# EAGLE design raindrops (EAGLE 6.3)
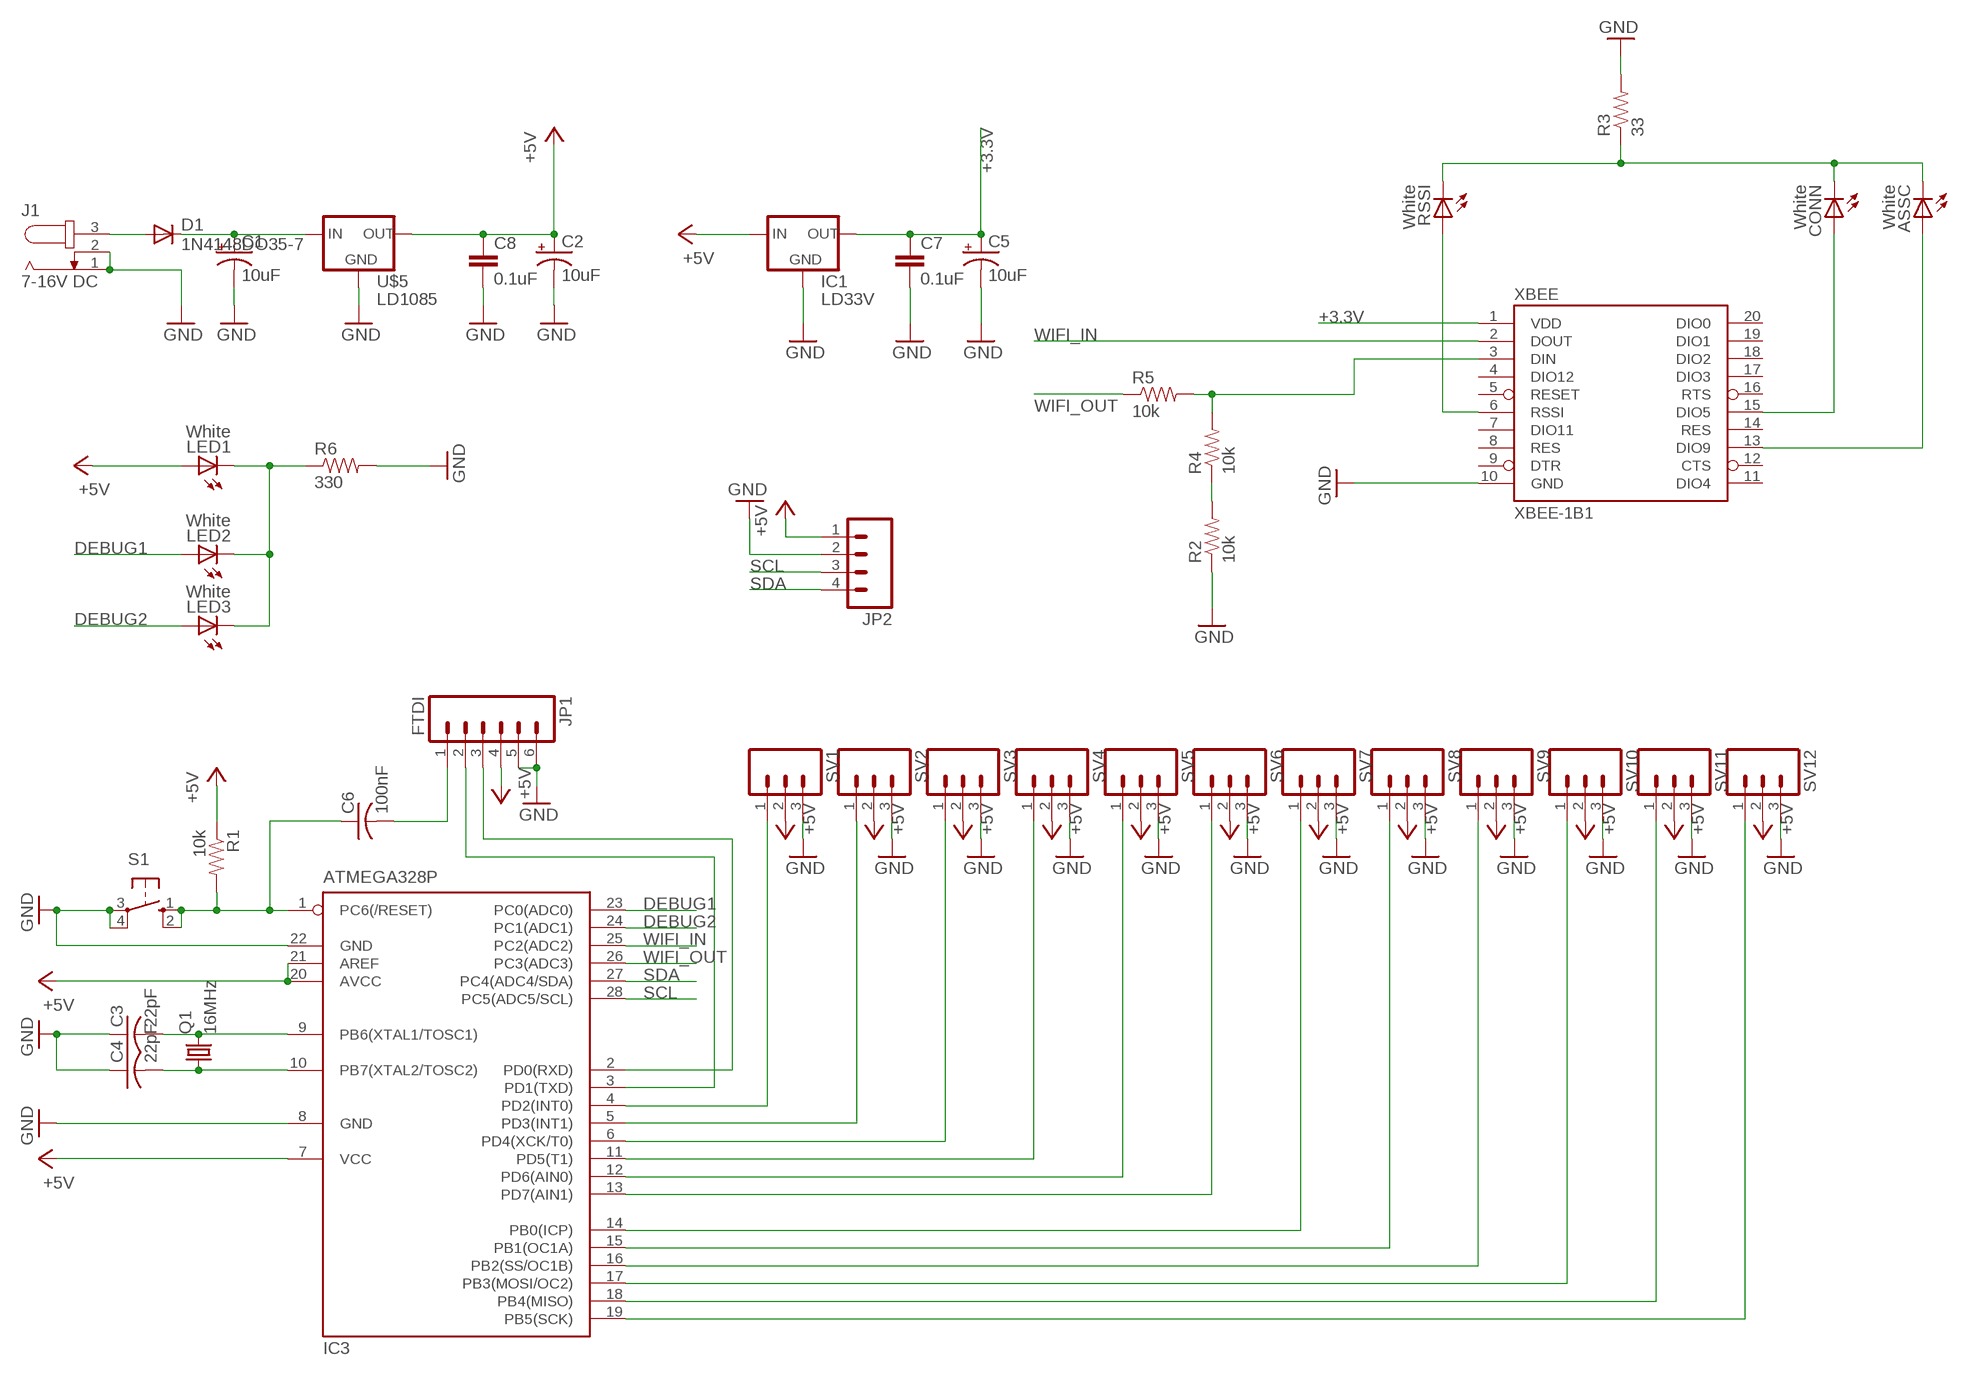
[diagram p0: schematic, sheet 1]

## Parts
ASSC  White  LEDCHIPLED_0603  [CHIPLED_0603]
C1  10uF  CAP_POLPTH2  [CPOL-RADIAL-10UF-25V]
C2  10uF  CAP_POLPTH2  [CPOL-RADIAL-10UF-25V]
C3  22pF  C-US025-025X050  [C025-025X050]
C4  22pF  C-US025-025X050  [C025-025X050]
C5  10uF  CAP_POLPTH2  [CPOL-RADIAL-10UF-25V]
C6  100nF  C-US025-025X050  [C025-025X050]
C7  0.1uF  .1UF-CER  [0402-CAP]
C8  0.1uF  .1UF-CER  [0402-CAP]
CONN  White  LEDCHIPLED_0603  [CHIPLED_0603]
D1  1N4148DO35-7  [DO35-7]
IC1  LD33V  V_REG_LD1117VXX  [78XXL]
IC3  ATMEGA328P  MEGA8-P  [DIL28-3]
J1  7-16V DC  JACK-PLUG0  [SPC4077]
JP1  FTDI  M06SIP  [1X06]
JP2  M04PTH  [1X04]
LED1  White  LEDCHIPLED_0603  [CHIPLED_0603]
LED2  White  LEDCHIPLED_0603  [CHIPLED_0603]
LED3  White  LEDCHIPLED_0603  [CHIPLED_0603]
Q1  16MHz  CRYSTALHC49S  [HC49/S]
R1  10k  RESISTOR0603-RES  [0603-RES]
R2  10k  RESISTOR0603-RES  [0603-RES]
R3  33  RESISTORAXIAL-0.3  [AXIAL-0.3]
R4  10k  RESISTOR0603-RES  [0603-RES]
R5  10k  RESISTOR0603-RES  [0603-RES]
R6  330  RESISTORAXIAL-0.3  [AXIAL-0.3]
RSSI  White  LEDCHIPLED_0603  [CHIPLED_0603]
S1  10-XX  [B3F-10XX]
SV1  M03PTH  [1X03]
SV2  M03PTH  [1X03]
SV3  M03PTH  [1X03]
SV4  M03PTH  [1X03]
SV5  M03PTH  [1X03]
SV6  M03PTH  [1X03]
SV7  M03PTH  [1X03]
SV8  M03PTH  [1X03]
SV9  M03PTH  [1X03]
SV10  M03PTH  [1X03]
SV11  M03PTH  [1X03]
SV12  M03PTH  [1X03]
U$5  LD1085  V_REG_LD1117VXX  [78XXL]
XBEE  XBEE-1B1  [XBEE-1]

## Nets
+3.3V: C5.1(+) C7.1 IC1.GND(OUT) XBEE.1(VDD)
+5V: C2.1(+) C8.1 IC1.OUT(IN) IC3.7(VCC) IC3.20(AVCC) IC3.21(AREF) JP1.4 JP2.1 LED1.A R1.1 SV1.2 SV2.2 SV3.2 SV4.2 SV5.2 SV6.2 SV7.2 SV8.2 SV9.2 SV10.2 SV11.2 SV12.2 U$5.GND(OUT)
ASSC: ASSC.A XBEE.13(DIO9)
CONN: CONN.A XBEE.15(DIO5)
CONN1: IC3.4(PD2(INT0)) SV1.1
CONN2: IC3.5(PD3(INT1)) SV2.1
CONN3: IC3.6(PD4(XCK/T0)) SV3.1
CONN4: IC3.11(PD5(T1)) SV4.1
CONN5: IC3.12(PD6(AIN0)) SV5.1
CONN6: IC3.13(PD7(AIN1)) SV6.1
CONN7: IC3.14(PB0(ICP)) SV7.1
CONN8: IC3.15(PB1(OC1A)) SV8.1
CONN9: IC3.16(PB2(SS/OC1B)) SV9.1
CONN10: IC3.17(PB3(MOSI/OC2)) SV10.1
CONN11: IC3.18(PB4(MISO)) SV11.1
CONN12: IC3.19(PB5(SCK)) SV12.1
DEBUG1: IC3.23(PC0(ADC0)) LED2.A
DEBUG2: IC3.24(PC1(ADC1)) LED3.A
GND: C1.2(-) C2.2(-) C3.1 C4.1 C5.2(-) C7.2 C8.2 IC1.IN(GND) IC3.8(GND) IC3.22(GND) J1.1 J1.2 JP1.5 JP1.6 JP2.2 R2.1 R3.P$2 R6.P$2 S1.3(P) S1.4(P1) SV1.3 SV2.3 SV3.3 SV4.3 SV5.3 SV6.3 SV7.3 SV8.3 SV9.3 SV10.3 SV11.3 SV12.3 U$5.IN(GND) XBEE.10(GND)
LED-RESISTOR: LED1.C LED2.C LED3.C R6.P$1
N$22: C6.2 JP1.1
RESET: C6.1 IC3.1(PC6(/RESET)) R1.2 S1.1(S) S1.2(S1)
RSSI: RSSI.A XBEE.6(RSSI)
RXO: IC3.2(PD0(RXD)) JP1.3
SCL: IC3.28(PC5(ADC5/SCL)) JP2.3
SDA: IC3.27(PC4(ADC4/SDA)) JP2.4
TXO: IC3.3(PD1(TXD)) JP1.2
V-DIV: R2.2 R4.1
VIN-POST-DIODE: C1.1(+) D1.C U$5.OUT(IN)
VIN-PRE-DIODE: D1.A J1.3
WIFI_IN: IC3.25(PC2(ADC2)) XBEE.2(DOUT)
WIFI_OUT: IC3.26(PC3(ADC3)) R5.1
XBEE-DIN: R4.2 R5.2 XBEE.3(DIN)
XBEE-LED-RESISTOR: ASSC.C CONN.C R3.P$1 RSSI.C
XTAL1: C3.2 IC3.9(PB6(XTAL1/TOSC1)) Q1.2
XTAL2: C4.2 IC3.10(PB7(XTAL2/TOSC2)) Q1.1
Unconnected: XBEE.4(DIO12) XBEE.5(RESET) XBEE.7(DIO11) XBEE.8(RES) XBEE.9(DTR) XBEE.11(DIO4) XBEE.12(CTS) XBEE.14(RES) XBEE.16(RTS) XBEE.17(DIO3) XBEE.18(DIO2) XBEE.19(DIO1) XBEE.20(DIO0)

## Library data of the parts
ASSC CONN LED1-LED3 RSSI = led:LED: LED OSRAM: - CHIPLED LG R971, LG N971, LY N971, LG Q971, LY Q971, LO R971, LY R971 LH N974, LH R974 LS Q976, LO Q976, LY Q976 LO Q996 - Hyper CHIPLED LW Q18S LB Q993, LB Q99A, LB R99A - SideLED LS A670, LO A670, LY A670, LG A670, LP A670 LB A673, LV A673, LT A673, LW A673 LH A674 LY A675 LS A676, LA A676, LO A676, LY A676, LW A676 LS A679, LY A679, LG A679 - Hyper Micro SIDELED® LS Y876, LA Y876, LO Y876, LY Y876 LT Y87S - SmartLED LW L88C, LW L88S LB L89C, LB L89S, LG L890 LS L89K, LO L89K, LY L89K LS L896, LA L896, LO L896, LY L896 - TOPLED LS T670, LO T670, LY T670, LG T670, LP T670 LSG T670, LSP T670, LSY T670, LOP T670, LYG T670 LG T671, LOG T671, LSG T671 LB T673, LV T673, LT T673, LW T673 LH T674 LS T676, LA T676, LO T676, LY T676, LB T676, LH T676, LSB T676, LW T676 LB T67C, LV T67C, LT T67C, LS T67K, LO T67K, LY T67K, LW E67C LS E67B, LA E67B, LO E67B, LY E67B, LB E67C, LV E67C, LT E67C LW T67C LS T679, LY T679, LG T679 LS T770, LO T770, LY T770, LG T770, LP T770 LB T773, LV T773, LT T773, LW T773 LH T774 LS E675, LA E675, LY E675, LS T675 LS T776, LA T776, LO T776, LY T776, LB T776 LHGB T686 LT T68C, LB T68C - Hyper Mini TOPLED® LB M676 - Mini TOPLED Santana® LG M470 LS M47K, LO M47K, LY M47K Source: http://www.osram.convergy.de LUXEON: - LUMILED® LXK2-PW12-R00, LXK2-PW12-S00, LXK2-PW14-U00, LXK2-PW14-V00 LXK2-PM12-R00, LXK2-PM12-S00, LXK2-PM14-U00 LXK2-PE12-Q00, LXK2-PE12-R00, LXK2-PE12-S00, LXK2-PE14-T00, LXK2-PE14-U00 LXK2-PB12-K00, LXK2-PB12-L00, LXK2-PB12-M00, LXK2-PB14-N00, LXK2-PB14-P00, LXK2-PB14-Q00 LXK2-PR12-L00, LXK2-PR12-M00, LXK2-PR14-Q00, LXK2-PR14-R00 LXK2-PD12-Q00, LXK2-PD12-R00, LXK2-PD12-S00 LXK2-PH12-R00, LXK2-PH12-S00 LXK2-PL12-P00, LXK2-PL12-Q00, LXK2-PL12-R00 Source: www.luxeon.com KINGBRIGHT: KA-3528ASYC Source: www.kingbright.com
C1 C2 C5 = SparkFun-Passives:CAP_POL: Capacitor Polarized These are standard SMD and PTH capacitors. Normally 10uF, 47uF, and 100uF in electrolytic and tantalum varieties. Always verify the external diameter of the through hole cap, it varies with capacity, voltage, and manufacturer. The EIA devices should be standard.
C3 C4 C6 = rcl:C-US: CAPACITOR, American symbol
C7 C8 = SparkFun-Capacitors:.1UF-CER: .1uF ceramic SMT CAP-00810- 25V +80%/-20% (0603) CAP-08390- 100V 10% (0603) CAP-08604- 25V 5% (0603); PROD_ID: CAP-00810
D1 = diode:1N4148: DIODE high speed (Philips)
IC1 U$5 = SparkFun-PowerIC:V_REG_LD1117VXX: LD1117VXX voltage regulator. We carry the 3.3V version (COM-00526) in TO-220 package.
IC3 = atmel:MEGA8-P: MICROCONTROLLER 8 Kbytes FLASH, 1 kbytes SRAM, 512 bytes EEPROM, USART, 4-channel 10 bit ADC, 2-channel 8 bit ADC Pin compatible with Atmega48, ATMega88, ATMega168 Source: avr.lbr; OC_FARNELL: unknown; OC_NEWARK: unknown
J1 = con-jack:JACK-PLUG: DC POWER JACK Power Jack, DC, Right Angle, Through Hole, Rated 5A at 16VDC, PC Terminals Distributor: Farnell (www.Farnell.de) Drawing: 84N1161.pdf / 84N1162.pdf Manufacturer: SPC Technology (www.spctechnology.com) Type: SPC4077 / SPC 4078; OC_FARNELL: unknown; OC_NEWARK: unknown
JP1 = SparkFun-Connectors:M06: Header 6 Standard 6-pin 0.1" header. Use with straight break away headers (SKU : PRT-00116), right angle break away headers (PRT-00553), swiss pins (PRT-00743), machine pins (PRT-00117), and female headers (PRT-00115). Molex polarized connector foot print use with SKU : PRT-08094 with associated crimp pins and housings. NOTES ON THE VARIANTS LOCK and LOCK_LONGPADS... This footprint was designed to help hold the alignment of a through-hole component (i.e. 6-pin header) while soldering it into place. You may notice that each hole has been shifted either up or down by 0.005 of an inch from it's more standard position (which is a perfectly straight line). This slight alteration caused the pins (the squares in the middle) to touch the edges of the holes. Because they are alternating, it causes a "brace" to hold the component in place. 0.005 has proven to be the perfect amount of "off-center" position when using our standard breakaway headers. Although looks a little odd when you look at the bare footprint, once you have a header in there, the alteration is very hard to notice. Also, if you push a header all the way into place, it is covered up entirely on the bottom side. This idea of altering the position of holes to aid alignment will be further integrated into the Sparkfun Library for other footprints. It can help hold any component with 3 or more connection pins.
JP2 = SparkFun-Connectors:M04: Header 4 Standard 4-pin 0.1" header. Use with straight break away headers (SKU : PRT-00116), right angle break away headers (PRT-00553), swiss pins (PRT-00743), machine pins (PRT-00117), and female headers (PRT-00115). Molex polarized connector foot print use with SKU : PRT-08231 with associated crimp pins and housings. 1MM SMD Version SKU: PRT-10208
Q1 = crystal:CRYSTAL: CRYSTAL; OC_FARNELL: 1667008; OC_NEWARK: unknown
R1-R6 = SparkFun-Resistors:RESISTOR: Resistor Basic schematic elements and footprints for 0603, 1206, and PTH resistors.
S1 = switch-omron:10-XX: OMRON SWITCH; MPN: B3F-1000; OC_FARNELL: 176432; OC_NEWARK: 36M3542
SV1-SV12 = SparkFun-Connectors:M03: Header 3 Standard 3-pin 0.1" header. Use with straight break away headers (SKU : PRT-00116), right angle break away headers (PRT-00553), swiss pins (PRT-00743), machine pins (PRT-00117), and female headers (PRT-00115). Molex polarized connector foot print use with SKU : PRT-08232 with associated crimp pins and housings.
XBEE = SparkFun-RF:XBEE-1: Xbee module footprints SMT header is CONN-09042.

## Board
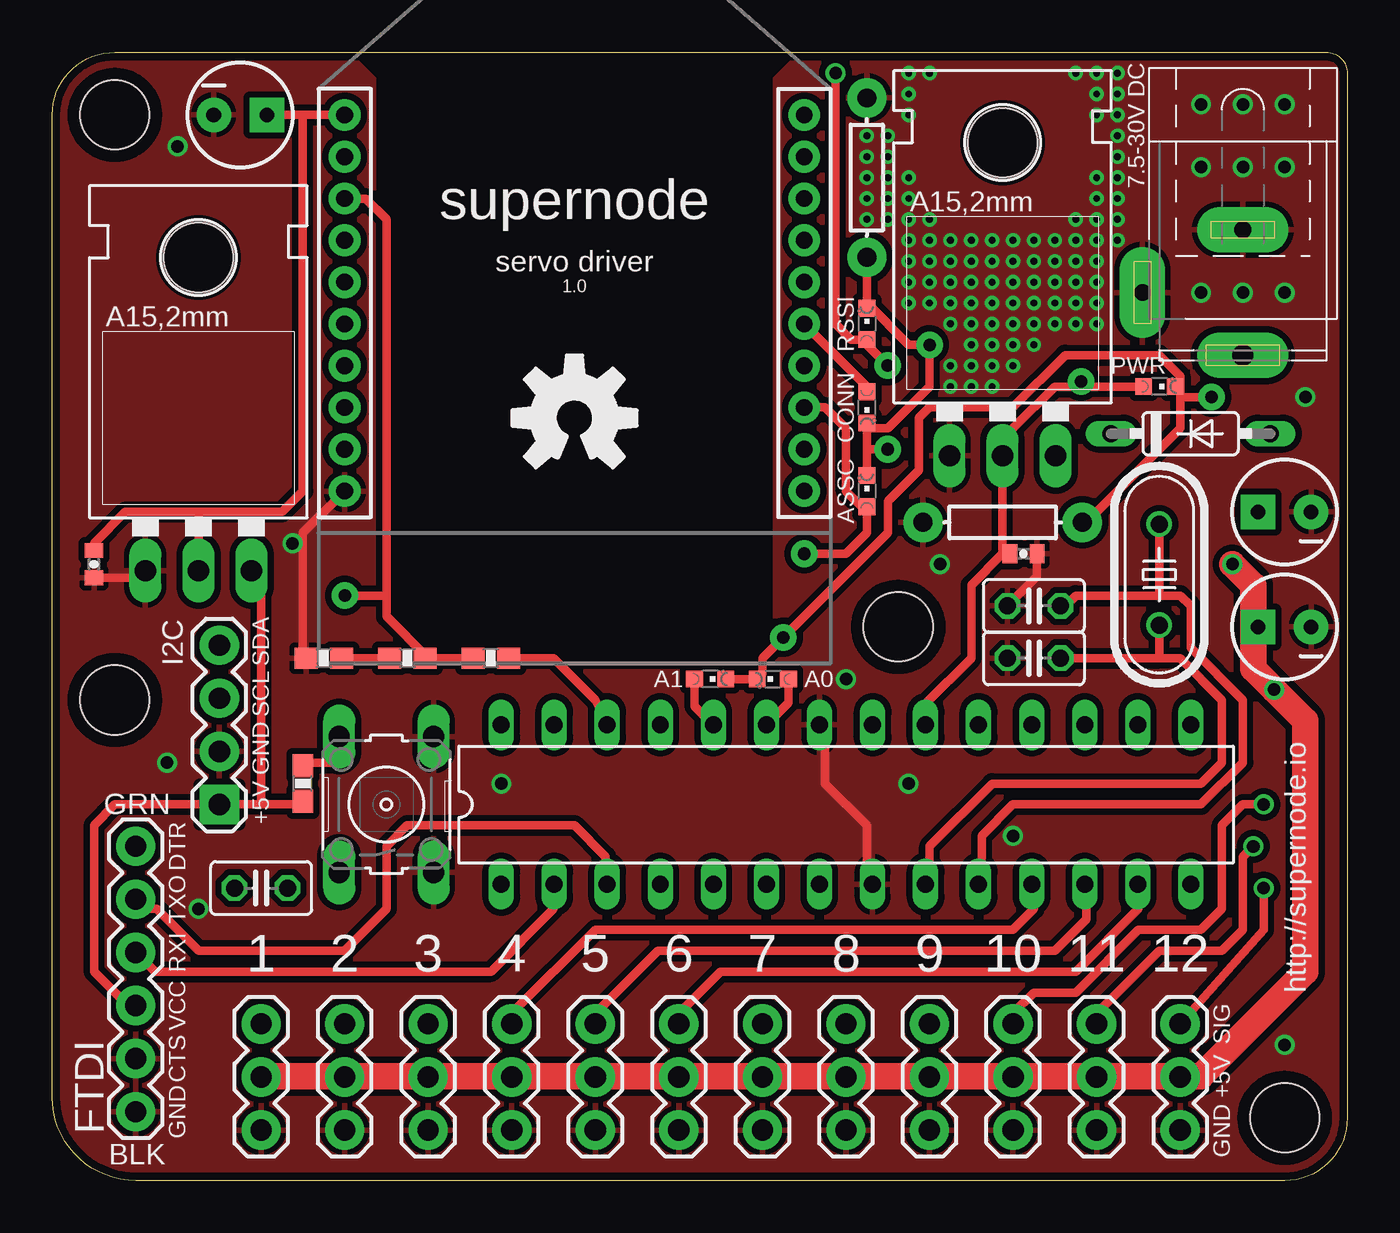
[diagram p1: board, top side]
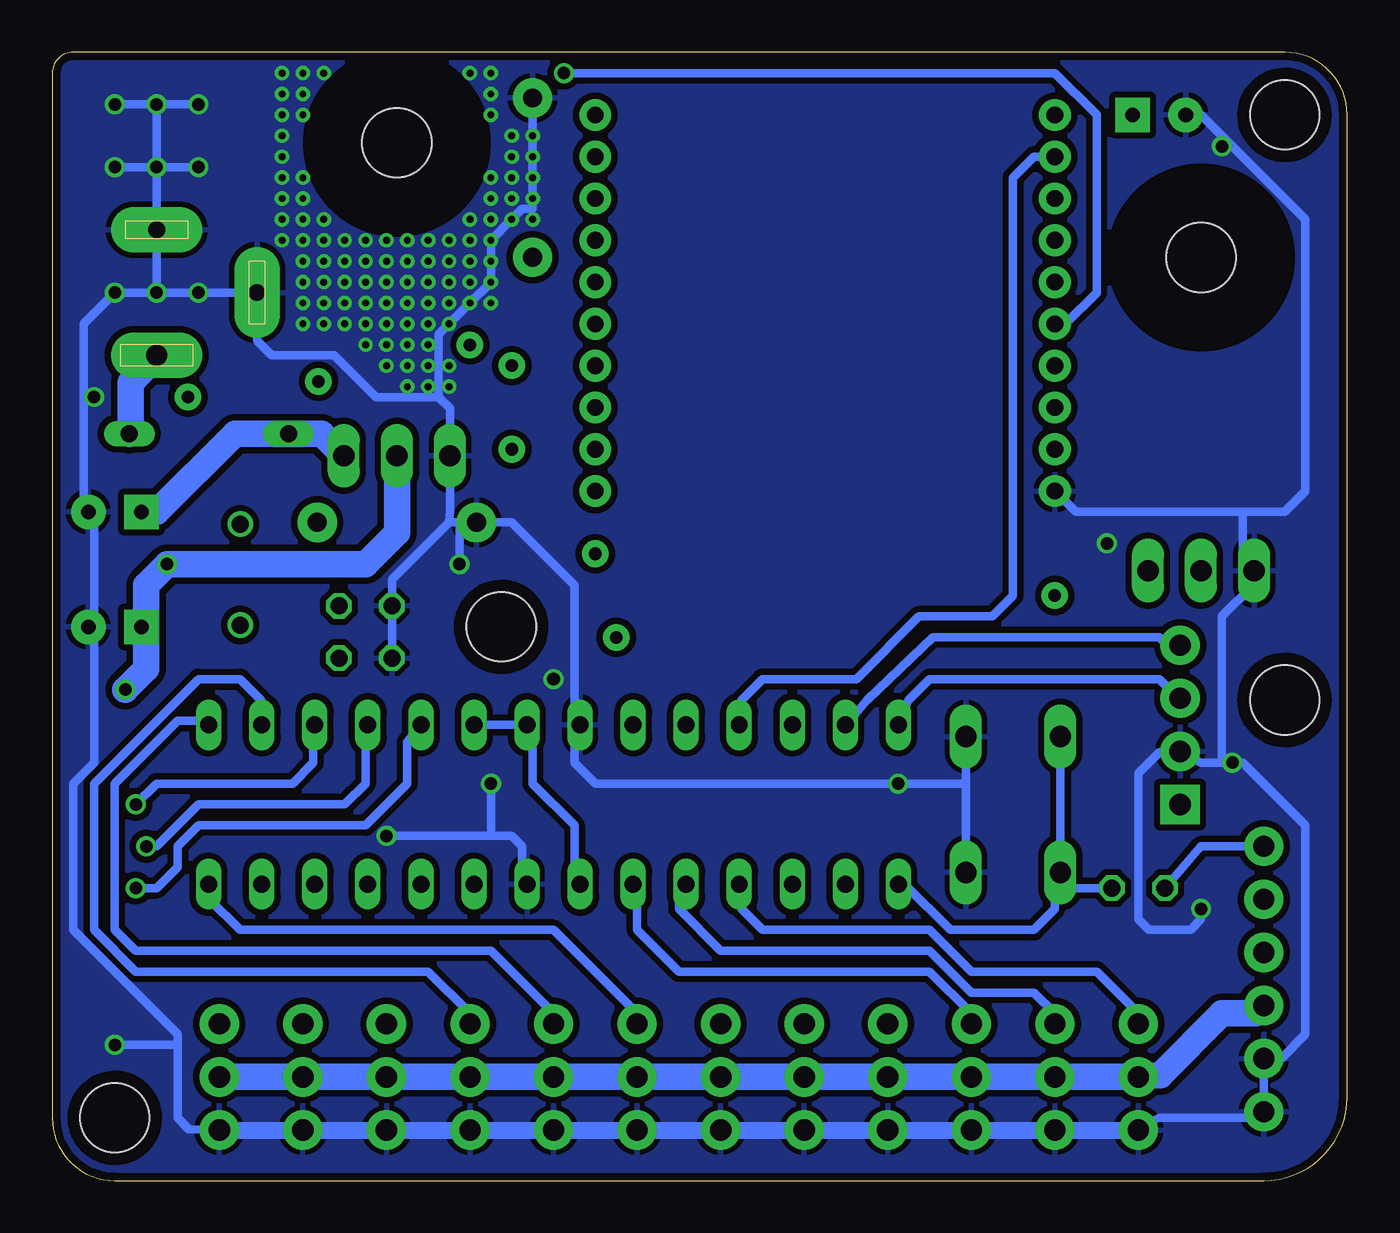
[diagram p2: board, bottom side, seen from below]

Size 62 x 54 mm. Coordinates in mm from the lower left corner, seen from the top.
Outline: 3,54 61,54 arc-90 62,53 62,3 arc-90 59,0 4,0 arc-90 0,4 0,51 arc-90 3,54
Copper layers (1*16): Top 0.0356mm / dielectric 1.5011mm / Bottom 0.0356mm
Design rules "LaenPCBOrder *": minimum track width 6mil, minimum drill 13mil, track to track 6mil, track to pad 6mil, pad to pad 6mil, via to via 6mil, smd to smd 6mil, copper to edge 15mil, drill to drill 6mil, minimum pad ring 7mil, minimum via ring 7mil, stop-mask expansion 4mil, vias tented up to drill 25mil, thermal gap 10mil
tRestrict: area 15,25 to 35,54

### Footprints (pad centres in the part's own frame; a part is rotated, then mirrored left to right if it is on the bottom)
CHIPLED_0603 = smd 0.8 x 0.8: A 0,-0.75; C 0,0.75
CPOL-RADIAL-10UF-25V = drill 0.7 pad 1.651 square: 1 1.27,0 | drill 0.7 pad 1.651: 2 -1.27,0
C025-025X050 = drill 0.813 octagon: 1 -1.27,0; 2 1.27,0
0402-CAP = smd 0.7 x 0.9: 1 -0.65,0; 2 0.65,0
DO35-7 = drill 0.813 long: A 3.81,0; C -3.81,0
78XXL = drill 1.016 long: GND 0,-3.81; IN -2.54,-3.81; OUT 2.54,-3.81 | hole 3.302: 0,11.176
DIL28-3 = drill 0.813 long: 1 -16.51,-3.81; 2 -13.97,-3.81; 3 -11.43,-3.81; 4 -8.89,-3.81; 5 -6.35,-3.81; 6 -3.81,-3.81; 7 -1.27,-3.81; 8 1.27,-3.81; 9 3.81,-3.81; 10 6.35,-3.81; 11 8.89,-3.81; 12 11.43,-3.81; 13 13.97,-3.81; 14 16.51,-3.81; 15 16.51,3.81; 16 13.97,3.81; 17 11.43,3.81; 18 8.89,3.81; 19 6.35,3.81; 20 3.81,3.81; 21 1.27,3.81; 22 -1.27,3.81; 23 -3.81,3.81; 24 -6.35,3.81; 25 -8.89,3.81; 26 -11.43,3.81; 27 -13.97,3.81; 28 -16.51,3.81
SPC4077 = drill 0.8 pad 2.184 long: 1 -3,0; 2 0,-4.8 | drill 1 pad 2.184 long: 3 3,0
1X06 = drill 1.016 pad 1.88: 1 0,0; 2 2.54,0; 3 5.08,0; 4 7.62,0; 5 10.16,0; 6 12.7,0
1X04 = drill 1.016 pad 1.88 square: 1 0,0 | drill 1.016 pad 1.88: 2 2.54,0; 3 5.08,0; 4 7.62,0
HC49/S = drill 0.813: 1 -2.413,0; 2 2.413,0
0603-RES = smd 1.1 x 1: 1 -0.85,0; 2 0.85,0
AXIAL-0.3 = drill 0.9 pad 1.88: P$1 -3.81,0; P$2 3.81,0
B3F-10XX = drill 1.016 long: 1 -3.251,2.261; 2 3.251,2.261; 3 -3.251,-2.261; 4 3.251,-2.261
1X03 = drill 1.016 pad 1.88: 1 0,0; 2 2.54,0; 3 5.08,0
STAND-OFF = hole 3.302: 0,0
XBEE-1 = drill 0.8 pad 1.524: 1 -11,20; 2 -11,18; 3 -11,16; 4 -11,14; 5 -11,12; 6 -11,10; 7 -11,8; 8 -11,6; 9 -11,4; 10 -11,2; 11 11,2; 12 11,4; 13 11,6; 14 11,8; 15 11,10; 16 11,12; 17 11,14; 18 11,16; 19 11,18; 20 11,20

### Placement (x,y rotation side)
ASSC  39,33 0 top
C1  59,32 180 top
C2  59,26.5 180 top
C3  47,25 0 top
C4  47,27.5 0 top
C5  9,51 0 top
C6  10,14 180 top
C7  2,29.5 270 top
C8  46.5,30 0 top
CONN  39,37 180 top
D1  54.5,35.75 0 top
IC1  7,33 0 top
IC3  38,18 0 top
J1  57,42.5 270 top
JP1  4,16 270 top
JP2  8,18 90 top
LED1  53,38 270 top
LED2  34.5,24 90 top
LED3  31.5,24 270 top
Q1  53,29 270 top
R1  12,19 90 top
R2  13,25 0 top
R3  39,48 90 top
R4  17,25 0 top
R5  21,25 180 top
R6  45.5,31.5 180 top
RSSI  39,41 0 top
S1  16,18 90 top
SV1  10,7.5 270 top
SV2  14,7.5 270 top
SV3  18,7.5 270 top
SV4  22,7.5 270 top
SV5  26,7.5 270 top
SV6  30,7.5 270 top
SV7  34,7.5 270 top
SV8  38,7.5 270 top
SV9  42,7.5 270 top
SV10  46,7.5 270 top
SV11  50,7.5 270 top
SV12  54,7.5 270 top
U$1  [STAND-OFF]  3,51 0 top
U$2  [STAND-OFF]  3,23 0 top
U$3  [STAND-OFF]  40.5,26.5 0 top
U$4  [STAND-OFF]  59,3 0 top
U$5  45.5,38.5 0 top
XBEE  25,31 0 top

### Tracks (layer width: path | path; a pad name or v marks a point on that pad's centre or on a via)
+3.3V
  Top 0.406: IC1.GND 7,32 | 7,32 11,32 12,33 12,51 | 12,51 XBEE.1 | C5.1 12,51 | C7.1 2,30.5 3.5,32 7,32
+5V  (via drill 0.6, 0.6 pad 1.27)
  Top 0.406: 10,18 10,28.5 IC1.OUT | IC3.20 41.81,22.81 44,25 44,28.5 45.5,30 | 45.5,30 U$5.GND 45.5,35.19 46,36 48,38 49.25,38 | R1.1 12,18 10,18 | 10,18 JP2.1 3,18 2,17 2,10 3.27,8.73 3.65,8.73 JP1.4 | LED1.A 49.25,38 | 49.25,38 v49.25,38.25 | C8.1 45.5,30
  Top 0.813: 54.04,5 SV12.2
  Top 1.27: C2.1 57.5,26.5 | 57.5,26.5 57.5,24.5 v58.5,23.5 60,22 60,10 55,5 54.04,5 | v56.5,29.5 57.5,28.5 57.5,26.5 | SV12.2 53.96,5 10,5
  Bottom 0.406: IC3.20 IC3.21 39,21.5 39,19 37,17 37,14.46 IC3.7
  Bottom 1.27: SV12.2 SV11.2 SV10.2 SV9.2 SV8.2 SV7.2 SV6.2 SV5.2 SV4.2 SV3.2 SV2.2 SV1.2 8.96,5.04 6,8 4.38,8 JP1.4 | U$5.GND 45.5,31 47,29.5 v56.5,29.5 57.5,28.5 57.5,26.23 | 57.5,26.23 C2.1 | 57.5,26.23 57.5,24.5 v58.5,23.5
ASSC  (via drill 0.6 pad 1.27)
  Top 0.406: ASSC.A 39,32 | 39,32 38,33 38,36 37,37 XBEE.13 | 39,32 39,31 38,30 v36,30
CONN
  Top 0.406: CONN.A 39,38 XBEE.15
CONN1
  Bottom 0.406: SV1.1 10,8 12,10 18,10 20,12 28,12 29,13 29,14.08 IC3.4
CONN2
  Bottom 0.406: SV2.1 14,8 15,9 18,9 20,11 30,11 32,13 32,13.84 IC3.5
CONN3
  Bottom 0.406: SV3.1 18,8 20,10 32,10 34,12 34,14 IC3.6
CONN4
  Top 0.406: SV4.1 22,8 26,12 46,12 47,13 47,14.08 IC3.11
CONN5
  Top 0.406: SV5.1 26,8 29,11 48,11 49.5,12.5 49.5,14 IC3.12
CONN6
  Top 0.406: SV6.1 30,8 32,10 49,10 52,13 52,14.16 IC3.13
CONN7
  Bottom 0.406: SV7.1 34,8 38,12 53,12 54.5,13.5 IC3.14
CONN8
  Bottom 0.406: SV8.1 38,8 41,11 58,11 59,12 59,19 56,22 55,22 IC3.15
CONN9
  Bottom 0.406: SV9.1 42,8 44,10 58,10 60,12 60,19 55,24 53,24 52,23 52,22 IC3.16
CONN10  (via drill 0.6)
  Top 0.406: SV10.1 46,8 47,9 49,9 52,12 55,12 56,13 56,17 57,18 v58,18
  Bottom 0.406: IC3.17 49.5,21.5 49.5,20 50.5,19 57,19 v58,18
CONN11  (via drill 0.6)
  Top 0.406: SV11.1 50,8 53,11 56,11 57,12 57,15.5 v57.5,16
  Bottom 0.406: IC3.18 47,21 47,19 48,18 55,18 57,16 v57.5,16
CONN12  (via drill 0.6)
  Top 0.406: SV12.1 58,12 v58,14
  Bottom 0.406: IC3.19 45,21 45,19 47,17 55,17 56,16 56,15 57,14 v58,14
DEBUG1
  Top 0.406: LED2.A 35.25,22.87 IC3.23
DEBUG2
  Top 0.406: LED3.A 30.75,22.71 IC3.24
GND  (via drill 0.33, 0.33 pad 0.03, 0.6)
  Top 0.406: IC3.8 39,14.46 39,17 37,19 37,21.5 IC3.22 | R2.1 12,25 12,31 XBEE.10 | C7.2 4.12,28.85 IC1.IN | C8.2 47.15,28.92 C4.1
  Bottom 0.406: 37,21.54 IC3.22 | 37,21.54 37,20 36,19 v21.5,19 18.26,19 | S1.3 18.26,19 | 18.26,19 S1.4 | XBEE.10 13,32 5,32 | 5,32 5,30 IC1.IN 4.5,29.15 4.5,28.5 6,27 6,20 | SV1.3 9.81,2.65 9,3 4,3 JP1.6 JP1.5 3.16,5.84 2,7 2,17 5,20 v5.5,20 6,20 | 6,20 7,20 JP2.2 8.04,20.5 9,20.5 10,19.5 10,12.5 9.5,12 7.5,12 7,12.5 v7,13 | C5.2 7,51 5.5,49.5 | 5.5,49.5 2,46 2,33 3,32 5,32 | C3.1 C4.1 45.73,28.77 43,31.5 | SV12.3 55.46,2.46 56,3 56,6.5 | 56,6.5 56,7 61,12 61,19 60,20 60,26 | C2.2 60,26 | 60,26 60,32 | v57,42.5 J1.1 v57,48.5 | v57,42.5 v55,42.5 J1.2 52.2,40.2 51.5,39.5 48.5,39.5 46.5,37.5 43.5,37.5 | v57,42.5 v59,42.5 60.5,41 60.5,37.5 | 60.5,37.5 60.5,32.5 60,32 | 60,32 C1.2 | 43,31.5 42.96,32.04 U$5.IN 42.96,36.96 43.5,37.5 | 43,31.5 42.5,31.5 | 42.5,31.5 R6.P$2 40,31.5 37,28.5 37,21.54 | R3.P$2 v39,50 v39,49 v39,48 v39,47 39,46.5 39.5,46.5 v40,46 v41,45 v41,44 v41,43 v42,42 v43,41 43.5,40.5 43.5,37.5 | v42.5,29.5 42.5,31.5 | v60,37.5 60.5,37.5 | v55,51.5 v57,51.5 | v57,51.5 v59,51.5 | v59,48.5 v57,48.5 | v57,48.5 v55,48.5 | v57,48.5 v57,51.5 | v59,6.5 56,6.5 | v46,16.5 41,16.5 | v41,19 41,16.5 | 41,16.5 40,16.5 39.5,16 39.5,14.42 IC3.8 | v6,49.5 5.5,49.5
  Bottom 0.813: SV12.3 SV11.3 SV10.3 SV9.3 SV8.3 SV7.3 SV6.3 SV5.3 SV4.3 SV3.3 SV2.3 SV1.3
  other vias: 38,24 11.5,30.5 41,53 42,53 41,52 41,51 40,50 40,49 41,48 41,46 41,47 42,46 42,45 42,44 42,43 43,44 43,45 44,45 44,44 44,43 43,43 43,42 44,42 44,41 45,45 45,44 45,43 45,42 45,41 45,40 45,39 46,39 46,40 46,41 46,42 46,43 46,44 46,45 47,45 47,44 47,43 47,42 47,41 47,40 48,41 48,42 48,43 48,44 48,45 49,46 49,45 49,44 49,43 49,42 49,41 50,41 50,42 50,43 50,44 50,45 50,46 50,47 50,48 51,47 51,48 51,49 51,50 51,51 51,52 51,53 50,53 50,52 49,53 41,42 44,40 44,39 43,39 43,38 44,38 45,38 40,47 51,46 51,45 39,46 40,48 50,51
  pour Top (isolate 0.305): 3,54 61,54 arc-90 62,53 62,3 arc-90 59,0 4,0 arc-90 0,4 0,51 arc-90
  pour Bottom (isolate 0.305): 3,54 61,54 arc-90 62,53 62,3 arc-90 59,0 4,0 arc-90 0,4 0,51 arc-90
LED-RESISTOR  (via drill 0.6 pad 1.27)
  Top 0.406: LED3.C LED2.C 34,24.25 34,25 v35,26 40,31 40,32.5 41.5,34 41.5,36.5 42,37 46,37 48.5,39.5 53,39.5 54,38.5 54,38 | 54,37.5 54,36 49.5,31.5 R6.P$1 | LED1.C 54,38 | 54,38 54,37.5 | 54,37.5 v55.5,37.5
N$22
  Bottom 0.406: JP1.1 7,16 C6.2
RESET
  Top 0.406: R1.2 12,20 13.5,20 13.74,20.24 S1.2
  Bottom 0.406: S1.2 S1.1 14,14.49 14,14 | IC3.1 21.19,14.19 19,12 15,12 14,13 14,14 | C6.1 14,14
RSSI  (via drill 0.6, 0.6 pad 1.27)
  Top 0.406: v37.5,53 37.5,41 38.25,40.25 RSSI.A 39,40 v40,39
  Bottom 0.406: XBEE.6 13.5,41 12,42.5 12,51 14,53 v37.5,53
RXO
  Top 0.406: IC3.2 24,14.16 24,13 21,10 4.92,10 JP1.3
SCL
  Bottom 0.406: IC3.28 21,23 20,24 9,24 8,23 JP2.3
SDA
  Bottom 0.406: IC3.27 24,21.81 23,23 19.84,26 9,26 8.62,25.62 JP2.4
TXO
  Top 0.406: IC3.3 26.5,15.5 25,17 17,17 16,16 16,13 14,11 7,11 5,13 4.46,13 JP1.2
V-DIV
  Top 0.406: R2.2 R4.1
VIN-POST-DIODE
  Bottom 1.27: U$5.OUT 49.1,35.75 D1.C 53.25,35.75 57,32 C1.1
VIN-PRE-DIODE
  Bottom 1.27: J1.3 58.25,38.19 58.25,36 D1.A
WIFI_IN
  Bottom 0.406: XBEE.2 15,49 16,48 16,28 17,27 20.5,27 23.5,24 28,24 29,23 29,21.92 IC3.25
WIFI_OUT
  Top 0.406: R5.1 24,25 26,23 IC3.26
XBEE-DIN  (via drill 0.6 pad 1.27)
  Top 0.406: XBEE.3 15,47 16,46 16,28 | R5.2 R4.2 18,25 16,27 16,28 | v14,28 16,28
XBEE-LED-RESISTOR  (via drill 0.6 pad 1.27)
  Top 0.406: R3.P$1 39,42 | 39,42 RSSI.C | 39,35 ASSC.C | CONN.C 39,36 | 39,36 40,36 42,38 v42,40 41,40 39,42 | 39,36 39,35 | 39,35 v40,35
XTAL1
  Top 0.406: IC3.9 42,14.5 42,16 45,19 55,19 56,20 56,23 54,25 53,25 | 53,25 Q1.2 | C3.2 53,25
XTAL2
  Top 0.406: IC3.10 44.5,15.5 44.5,16.5 46,18 55,18 57,20 57,23 54.5,25.5 54.5,27.5 54,28 53,28 | 53,28 Q1.1 | C4.2 48.5,27.5 49,28 53,28

### Text on the board
tPlace: 7.5-30V DC | supernode | servo driver | 1.0 | RSSI | PWR | CONN | ASSC | I2C | SDA | A1 | A0 | SCL | GND | GRN | +5V | DTR | http://supernode.io | TXO | RXI | 1 | 2 | 3 | 4 | 5 | 6 | 7 | 8 | 9 | 10 | 11 | 12 | VCC | SIG | CTS | +5V | GND | FTDI | BLK | GND